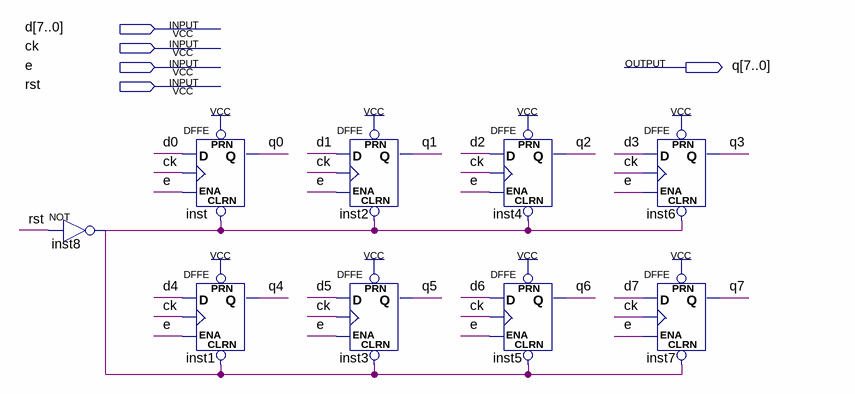
[diagram p0: schematic sheet]
// Quartus schematic reg_8_bits.bdf as structural Verilog: 9 symbols, 5 pins
module reg_8_bits (
  input  [7:0] d,
  input  ck,
  input  e,
  input  rst,
  output [7:0] q
);

  wire inst8_out;

  not inst8 (inst8_out, rst);
  DFFE inst (.PRN(1'b1), .CLRN(inst8_out), .D(d[0]), .CLK(ck), .ENA(e), .Q(q[0]));
  DFFE inst1 (.PRN(1'b1), .CLRN(inst8_out), .D(d[4]), .CLK(ck), .ENA(e), .Q(q[4]));
  DFFE inst2 (.PRN(1'b1), .CLRN(inst8_out), .D(d[1]), .CLK(ck), .ENA(e), .Q(q[1]));
  DFFE inst3 (.PRN(1'b1), .CLRN(inst8_out), .D(d[5]), .CLK(ck), .ENA(e), .Q(q[5]));
  DFFE inst4 (.PRN(1'b1), .CLRN(inst8_out), .D(d[2]), .CLK(ck), .ENA(e), .Q(q[2]));
  DFFE inst5 (.PRN(1'b1), .CLRN(inst8_out), .D(d[6]), .CLK(ck), .ENA(e), .Q(q[6]));
  DFFE inst6 (.PRN(1'b1), .CLRN(inst8_out), .D(d[3]), .CLK(ck), .ENA(e), .Q(q[3]));
  DFFE inst7 (.PRN(1'b1), .CLRN(inst8_out), .D(d[7]), .CLK(ck), .ENA(e), .Q(q[7]));
endmodule
